# EAGLE design TinyCube12abc_Lib (EAGLE 7.5.0)

## Sheet 1 of 2
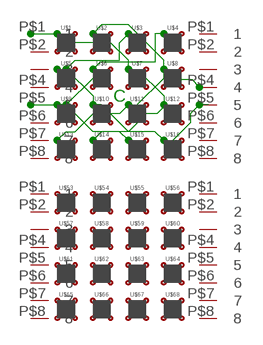
[diagram p0: schematic, sheet 1]

### Parts
JP1  TINY_HEADER_DEV  [TINY_HEADER_PKG]
JP2  TINY_HEADER_DEV  [TINY_HEADER_PKG]
JP3  TINY_HEADER_DEV  [TINY_HEADER_PKG]
JP4  TINY_HEADER_DEV  [TINY_HEADER_PKG]
U$1  PILLAR  [10MIL]
U$2  PILLAR  [10MIL]
U$3  PILLAR  [10MIL]
U$4  PILLAR  [10MIL]
U$5  PILLAR  [10MIL]
U$6  PILLAR  [10MIL]
U$7  PILLAR  [10MIL]
U$8  PILLAR  [10MIL]
U$9  PILLAR  [10MIL]
U$10  PILLAR  [10MIL]
U$11  PILLAR  [10MIL]
U$12  PILLAR  [10MIL]
U$13  PILLAR  [10MIL]
U$14  PILLAR  [10MIL]
U$15  PILLAR  [10MIL]
U$16  PILLAR  [10MIL]
U$53  PILLAR  [10MIL]
U$54  PILLAR  [10MIL]
U$55  PILLAR  [10MIL]
U$56  PILLAR  [10MIL]
U$57  PILLAR  [10MIL]
U$58  PILLAR  [10MIL]
U$59  PILLAR  [10MIL]
U$60  PILLAR  [10MIL]
U$61  PILLAR  [10MIL]
U$62  PILLAR  [10MIL]
U$63  PILLAR  [10MIL]
U$64  PILLAR  [10MIL]
U$65  PILLAR  [10MIL]
U$66  PILLAR  [10MIL]
U$67  PILLAR  [10MIL]
U$68  PILLAR  [10MIL]

### Nets
N$1: JP1.P$1 U$1.R(B) U$7.R(B) U$12.R(B) U$14.R(B)
N$2: JP2.P$4 U$2.R(B) U$8.R(B) U$11.R(B) U$13.R(B)
N$3: JP2.P$5 U$3.R(B) U$5.R(B) U$10.R(B) U$16.R(B)
N$5: JP1.P$5 U$4.R(B) U$6.R(B) U$9.R(B) U$15.R(B)
Unconnected: JP1.P$2 JP1.P$3 JP1.P$4 JP1.P$6 JP1.P$7 JP1.P$8 JP2.P$1 JP2.P$2 JP2.P$3 JP2.P$6 JP2.P$7 JP2.P$8 JP3.P$1 JP3.P$2 JP3.P$3 JP3.P$4 JP3.P$5 JP3.P$6 JP3.P$7 JP3.P$8 JP4.P$1 JP4.P$2 JP4.P$3 JP4.P$4 JP4.P$5 JP4.P$6 JP4.P$7 JP4.P$8 U$1.+(G) U$1.B(R) U$1.G(A) U$2.+(G) U$2.B(R) U$2.G(A) U$3.+(G) U$3.B(R) U$3.G(A) U$4.+(G) U$4.B(R) U$4.G(A) U$5.+(G) U$5.B(R) U$5.G(A) U$6.+(G) U$6.B(R) U$6.G(A) U$7.+(G) U$7.B(R) U$7.G(A) U$8.+(G) U$8.B(R) U$8.G(A) U$9.+(G) U$9.B(R) U$9.G(A) U$10.+(G) U$10.B(R) U$10.G(A) U$11.+(G) U$11.B(R) U$11.G(A) U$12.+(G) U$12.B(R) U$12.G(A) U$13.+(G) U$13.B(R) U$13.G(A) U$14.+(G) U$14.B(R) U$14.G(A) U$15.+(G) U$15.B(R) U$15.G(A) U$16.+(G) U$16.B(R) U$16.G(A) U$53.+(G) U$53.B(R) U$53.G(A) U$53.R(B) U$54.+(G) U$54.B(R) U$54.G(A) U$54.R(B) U$55.+(G) U$55.B(R) U$55.G(A) U$55.R(B) U$56.+(G) U$56.B(R) U$56.G(A) U$56.R(B) U$57.+(G) U$57.B(R) U$57.G(A) U$57.R(B) U$58.+(G) U$58.B(R) U$58.G(A) U$58.R(B) U$59.+(G) U$59.B(R) U$59.G(A) U$59.R(B) U$60.+(G) U$60.B(R) U$60.G(A) U$60.R(B) U$61.+(G) U$61.B(R) U$61.G(A) U$61.R(B) U$62.+(G) U$62.B(R) U$62.G(A) U$62.R(B) U$63.+(G) U$63.B(R) U$63.G(A) U$63.R(B) U$64.+(G) U$64.B(R) U$64.G(A) U$64.R(B) U$65.+(G) U$65.B(R) U$65.G(A) U$65.R(B) U$66.+(G) U$66.B(R) U$66.G(A) U$66.R(B) U$67.+(G) U$67.B(R) U$67.G(A) U$67.R(B) U$68.+(G) U$68.B(R) U$68.G(A) U$68.R(B)

### Notes on the sheet
- C

## Sheet 2 of 2
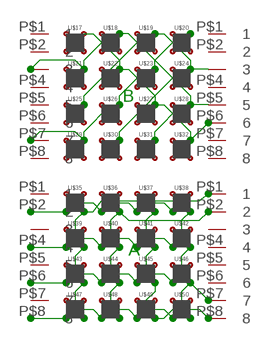
[diagram p1: schematic, sheet 2]

### Parts
U$17  PILLAR  [10MIL]
U$18  PILLAR  [10MIL]
U$19  PILLAR  [10MIL]
U$20  PILLAR  [10MIL]
U$21  PILLAR  [10MIL]
U$22  PILLAR  [10MIL]
U$23  PILLAR  [10MIL]
U$24  PILLAR  [10MIL]
U$25  PILLAR  [10MIL]
U$26  PILLAR  [10MIL]
U$27  PILLAR  [10MIL]
U$28  PILLAR  [10MIL]
U$29  PILLAR  [10MIL]
U$30  PILLAR  [10MIL]
U$31  PILLAR  [10MIL]
U$32  PILLAR  [10MIL]
U$33  TINY_HEADER_DEV  [TINY_HEADER_PKG]
U$34  TINY_HEADER_DEV  [TINY_HEADER_PKG]
U$35  PILLAR  [10MIL]
U$36  PILLAR  [10MIL]
U$37  PILLAR  [10MIL]
U$38  PILLAR  [10MIL]
U$39  PILLAR  [10MIL]
U$40  PILLAR  [10MIL]
U$41  PILLAR  [10MIL]
U$42  PILLAR  [10MIL]
U$43  PILLAR  [10MIL]
U$44  PILLAR  [10MIL]
U$45  PILLAR  [10MIL]
U$46  PILLAR  [10MIL]
U$47  PILLAR  [10MIL]
U$48  PILLAR  [10MIL]
U$49  PILLAR  [10MIL]
U$50  PILLAR  [10MIL]
U$51  TINY_HEADER_DEV  [TINY_HEADER_PKG]
U$52  TINY_HEADER_DEV  [TINY_HEADER_PKG]

### Nets
N$4: U$20.+(G) U$23.+(G) U$26.+(G) U$29.+(G) U$33.P$7
N$6: U$18.+(G) U$21.+(G) U$28.+(G) U$31.+(G) U$33.P$3 U$34.P$5
N$8: U$17.+(G) U$22.+(G) U$27.+(G) U$32.+(G) U$34.P$6
N$9: U$35.G(A) U$36.G(A) U$37.G(A) U$38.G(A) U$51.P$2
N$10: U$39.G(A) U$40.G(A) U$41.G(A) U$42.G(A) U$51.P$4
N$11: U$43.G(A) U$44.G(A) U$45.G(A) U$46.G(A) U$51.P$6
N$12: U$47.G(A) U$48.G(A) U$49.G(A) U$50.G(A) U$51.P$8
N$13: U$35.B(R) U$39.B(R) U$43.B(R) U$47.B(R) U$52.P$1
N$14: U$19.+(G) U$24.+(G) U$25.+(G) U$30.+(G) U$34.P$3
N$15: U$37.B(R) U$41.B(R) U$45.B(R) U$49.B(R) U$52.P$8
N$16: U$38.B(R) U$42.B(R) U$46.B(R) U$50.B(R) U$52.P$7
N$17: U$36.B(R) U$40.B(R) U$44.B(R) U$48.B(R) U$52.P$2
Unconnected: U$17.B(R) U$17.G(A) U$17.R(B) U$18.B(R) U$18.G(A) U$18.R(B) U$19.B(R) U$19.G(A) U$19.R(B) U$20.B(R) U$20.G(A) U$20.R(B) U$21.B(R) U$21.G(A) U$21.R(B) U$22.B(R) U$22.G(A) U$22.R(B) U$23.B(R) U$23.G(A) U$23.R(B) U$24.B(R) U$24.G(A) U$24.R(B) U$25.B(R) U$25.G(A) U$25.R(B) U$26.B(R) U$26.G(A) U$26.R(B) U$27.B(R) U$27.G(A) U$27.R(B) U$28.B(R) U$28.G(A) U$28.R(B) U$29.B(R) U$29.G(A) U$29.R(B) U$30.B(R) U$30.G(A) U$30.R(B) U$31.B(R) U$31.G(A) U$31.R(B) U$32.B(R) U$32.G(A) U$32.R(B) U$33.P$1 U$33.P$2 U$33.P$4 U$33.P$5 U$33.P$6 U$33.P$8 U$34.P$1 U$34.P$2 U$34.P$4 U$34.P$7 U$34.P$8 U$35.+(G) U$35.R(B) U$36.+(G) U$36.R(B) U$37.+(G) U$37.R(B) U$38.+(G) U$38.R(B) U$39.+(G) U$39.R(B) U$40.+(G) U$40.R(B) U$41.+(G) U$41.R(B) U$42.+(G) U$42.R(B) U$43.+(G) U$43.R(B) U$44.+(G) U$44.R(B) U$45.+(G) U$45.R(B) U$46.+(G) U$46.R(B) U$47.+(G) U$47.R(B) U$48.+(G) U$48.R(B) U$49.+(G) U$49.R(B) U$50.+(G) U$50.R(B) U$51.P$1 U$51.P$3 U$51.P$5 U$51.P$7 U$52.P$3 U$52.P$4 U$52.P$5 U$52.P$6

### Notes on the sheet
- B
- A

## Library data of the parts
JP1-JP4 U$33 U$34 U$51 U$52 = TinyHeader:TINY_HEADER_DEV
U$1-U$32 U$35-U$50 U$53-U$68 = PILLAR:PILLAR

## Board
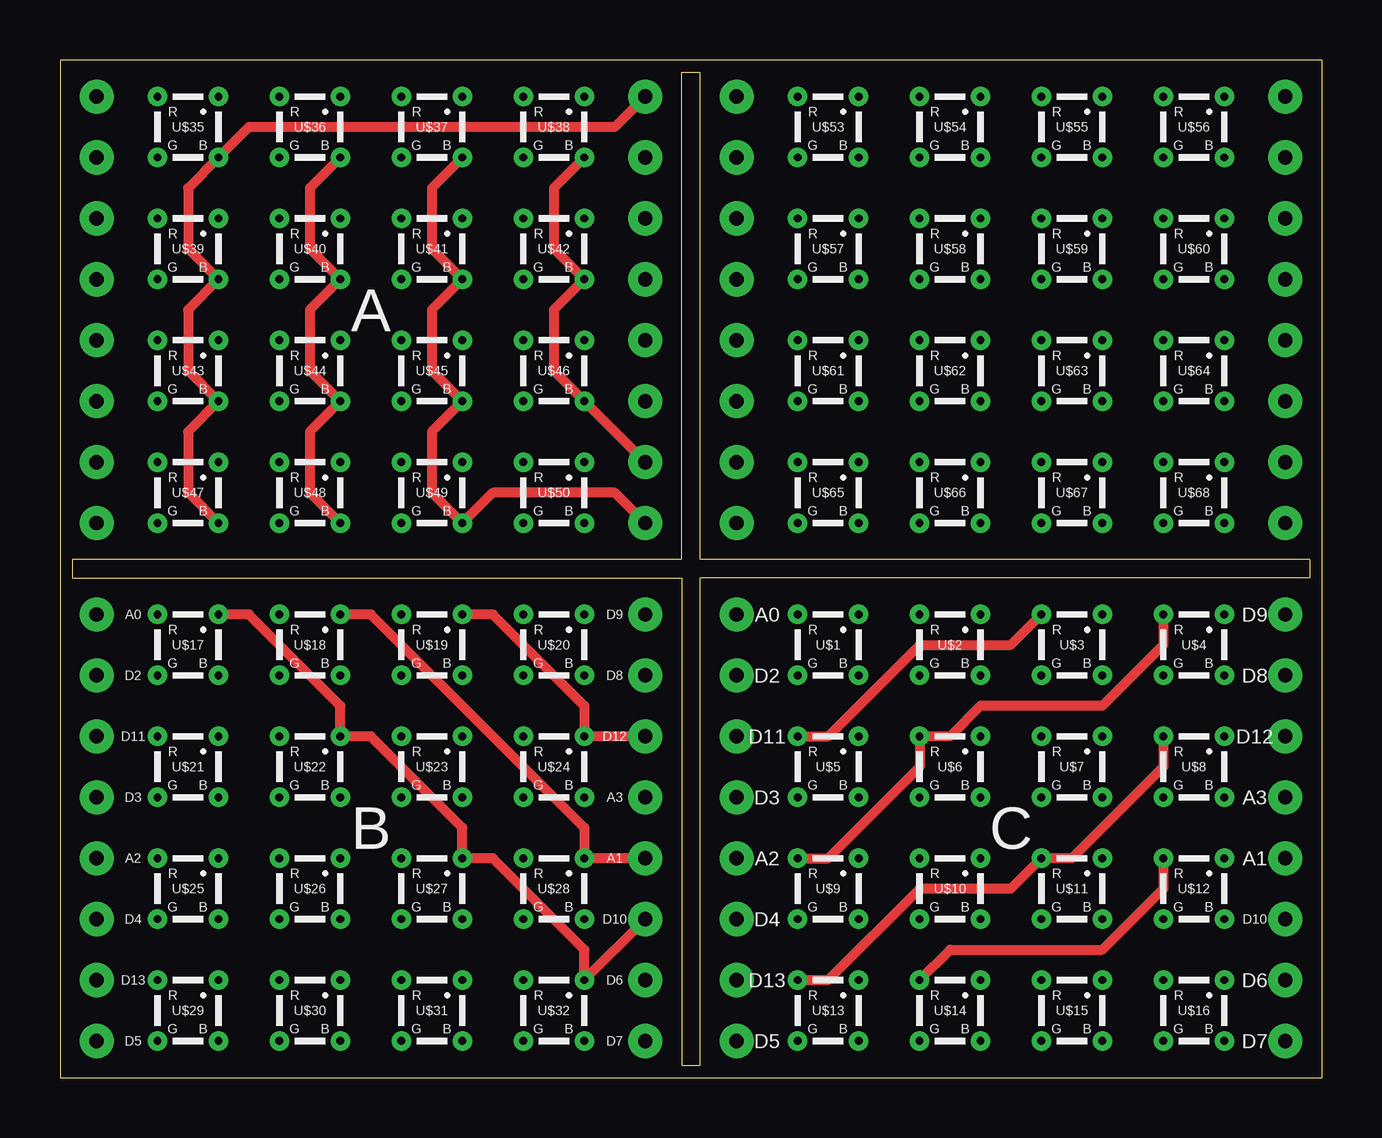
[diagram p2: board, top side]
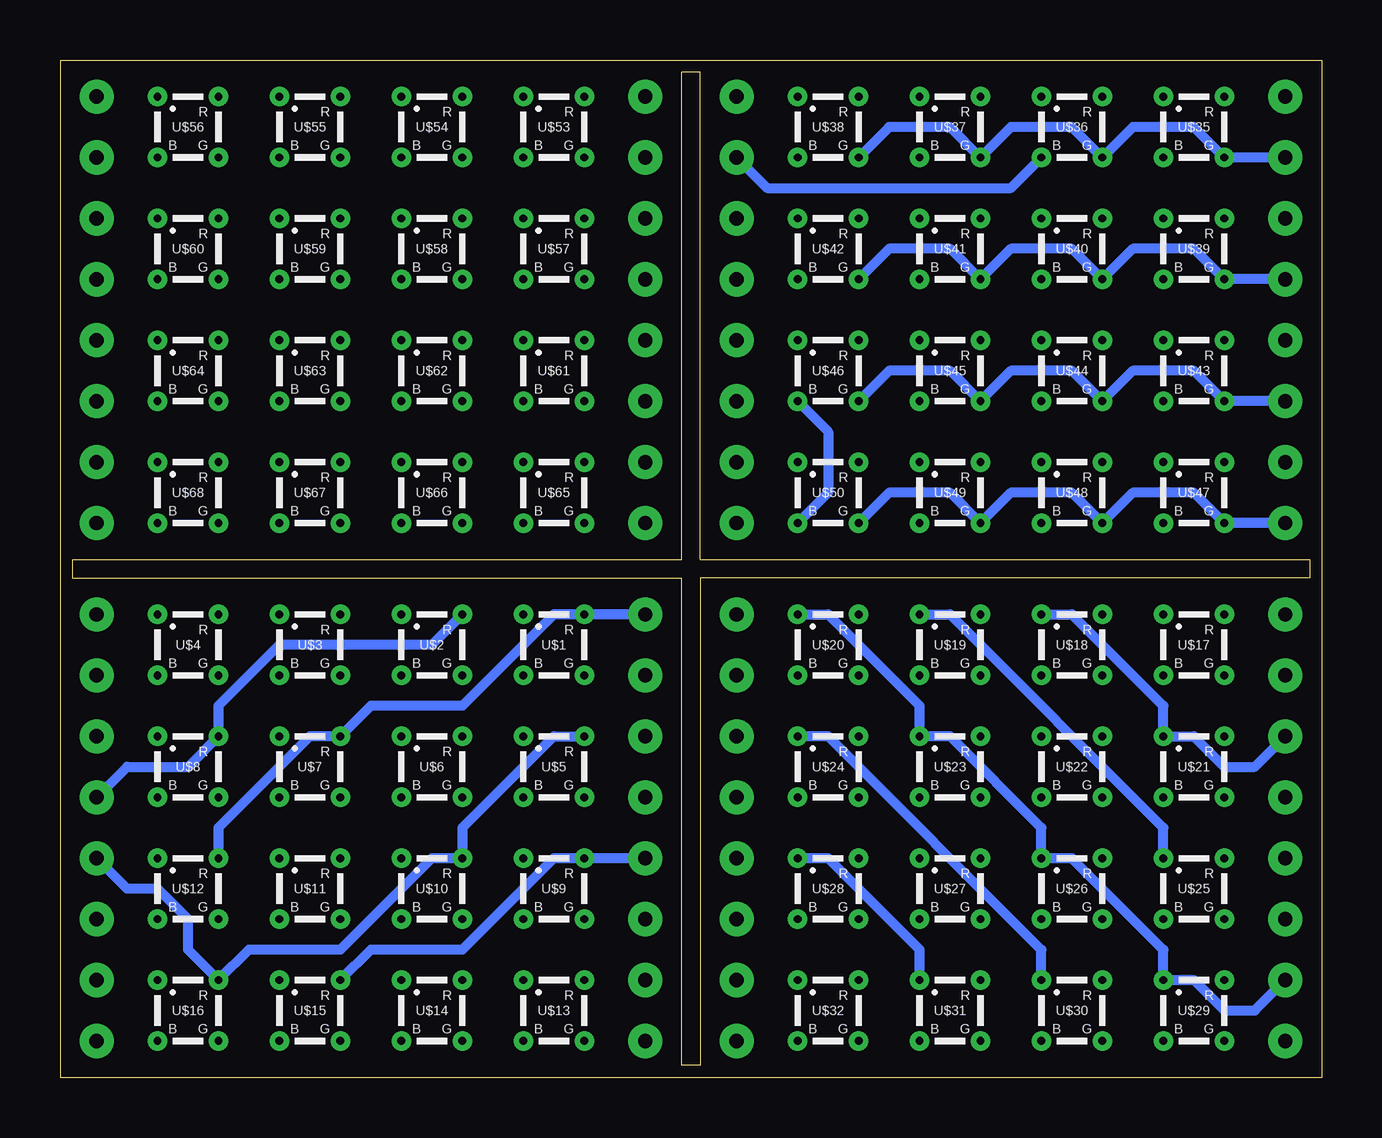
[diagram p3: board, bottom side, seen from below]

Size 52.58 x 42.42 mm. Coordinates in mm from the lower left corner, seen from the top.
Outline: 25.4,0 25.4,0
Outline: 52.58,42.42 52.58,0 0,0 0,42.42 52.58,42.42
Outline: 52.07,21.59 26.67,21.59 26.67,41.91 25.91,41.91 25.91,21.59 0.51,21.59 0.51,20.83 25.91,20.83 25.91,0.51 26.67,0.51 26.67,20.83 52.07,20.83 52.07,21.59
Copper layers (1*16): Top 0.0356mm / dielectric 1.5011mm / Bottom 0.0356mm
Design rules "LaenPCBOrder": minimum track width 6mil, minimum drill 13mil, track to track 6mil, track to pad 6mil, pad to pad 6mil, via to via 6mil, smd to smd 6mil, copper to edge 15mil, drill to drill 6mil, minimum pad ring 7mil, minimum via ring 7mil, stop-mask expansion 3mil, vias tented up to drill 0mil, thermal gap 10mil

### Footprints (pad centres in the part's own frame; a part is rotated, then mirrored left to right if it is on the bottom)
TINY_HEADER_PKG = drill 0.6 pad 1.422: P$1 0,0; P$2 0,-2.54; P$3 0,-5.08; P$4 0,-7.62; P$5 0,-10.16; P$6 0,-12.7; P$7 0,-15.24; P$8 0,-17.78
10MIL = drill 0.33 pad 0.813: + 1.27,1.27; B 1.27,-1.27; G -1.27,-1.27; R -1.27,1.27

### Placement (x,y rotation side)
JP1  28.19,19.3 0 top
JP2  51.05,19.3 0 top
JP3  28.19,40.89 0 top
JP4  51.05,40.89 0 top
U$1  32,18.03 0 top
U$2  37.08,18.03 0 top
U$3  42.16,18.03 0 top
U$4  47.24,18.03 0 top
U$5  32,12.95 0 top
U$6  37.08,12.95 0 top
U$7  42.16,12.95 0 top
U$8  47.24,12.95 0 top
U$9  32,7.87 0 top
U$10  37.08,7.87 0 top
U$11  42.16,7.87 0 top
U$12  47.24,7.87 0 top
U$13  32,2.79 0 top
U$14  37.08,2.79 0 top
U$15  42.16,2.79 0 top
U$16  47.24,2.79 0 top
U$17  5.33,18.03 0 top
U$18  10.41,18.03 0 top
U$19  15.49,18.03 0 top
U$20  20.57,18.03 0 top
U$21  5.33,12.95 0 top
U$22  10.41,12.95 0 top
U$23  15.49,12.95 0 top
U$24  20.57,12.95 0 top
U$25  5.33,7.87 0 top
U$26  10.41,7.87 0 top
U$27  15.49,7.87 0 top
U$28  20.57,7.87 0 top
U$29  5.33,2.79 0 top
U$30  10.41,2.79 0 top
U$31  15.49,2.79 0 top
U$32  20.57,2.79 0 top
U$33  1.52,19.3 0 top
U$34  24.38,19.3 0 top
U$35  5.33,39.62 0 top
U$36  10.41,39.62 0 top
U$37  15.49,39.62 0 top
U$38  20.57,39.62 0 top
U$39  5.33,34.54 0 top
U$40  10.41,34.54 0 top
U$41  15.49,34.54 0 top
U$42  20.57,34.54 0 top
U$43  5.33,29.46 0 top
U$44  10.41,29.46 0 top
U$45  15.49,29.46 0 top
U$46  20.57,29.46 0 top
U$47  5.33,24.38 0 top
U$48  10.41,24.38 0 top
U$49  15.49,24.38 0 top
U$50  20.57,24.38 0 top
U$51  1.52,40.89 0 top
U$52  24.38,40.89 0 top
U$53  32,39.62 0 top
U$54  37.08,39.62 0 top
U$55  42.16,39.62 0 top
U$56  47.24,39.62 0 top
U$57  32,34.54 0 top
U$58  37.08,34.54 0 top
U$59  42.16,34.54 0 top
U$60  47.24,34.54 0 top
U$61  32,29.46 0 top
U$62  37.08,29.46 0 top
U$63  42.16,29.46 0 top
U$64  47.24,29.46 0 top
U$65  32,24.38 0 top
U$66  37.08,24.38 0 top
U$67  42.16,24.38 0 top
U$68  47.24,24.38 0 top

### Tracks (layer width: path | path; a pad name or v marks a point on that pad's centre or on a via)
N$1
  Top 0.406: U$14.R 37.08,5.33 43.43,5.33 45.97,7.87 U$12.R
  Bottom 0.406: JP1.P$1 U$1.R 32,19.3 35.81,15.49 39.62,15.49 U$7.R 42.16,14.22 45.97,10.41 U$12.R
N$2
  Top 0.406: U$8.R 45.97,12.95 42.16,9.14 U$11.R 39.62,7.87 35.81,7.87 32,4.06 U$13.R
  Bottom 0.406: U$2.R 37.08,18.03 43.43,18.03 45.97,15.49 U$8.R 47.24,12.95 49.78,12.95 JP2.P$4
N$3
  Top 0.406: U$5.R 32,14.22 35.81,18.03 39.62,18.03 U$3.R
  Bottom 0.406: U$5.R 32,14.22 35.81,10.41 U$10.R 37.08,9.14 40.89,5.33 44.7,5.33 U$16.R 47.24,5.33 47.24,6.6 48.51,7.87 49.78,7.87 JP2.P$5
N$4
  Bottom 0.406: U$20.+ 20.57,19.3 16.76,15.49 U$23.+ 15.49,14.22 11.68,10.41 U$26.+ 10.41,9.14 6.6,5.33 U$29.+ 5.33,4.06 4.06,2.79 2.79,2.79 U$33.P$7
N$5
  Top 0.406: U$9.R 32,9.14 35.81,12.95 U$6.R 37.08,14.22 38.35,15.49 43.43,15.49 45.97,18.03 U$4.R
  Bottom 0.406: U$15.R 39.62,5.33 35.81,5.33 32,9.14 U$9.R JP1.P$5
N$6
  Top 0.406: U$18.+ 12.95,19.3 21.84,10.41 U$28.+ U$34.P$5
  Bottom 0.406: U$31.+ 16.76,5.33 20.57,9.14 U$28.+ | U$18.+ 10.41,19.3 6.6,15.49 U$21.+ 5.33,14.22 4.06,12.95 2.79,12.95 U$33.P$3
N$8
  Top 0.406: U$17.+ 7.87,19.3 11.68,15.49 U$22.+ 12.95,14.22 16.76,10.41 U$27.+ 18.03,9.14 21.84,5.33 U$32.+ U$34.P$6
N$9
  Bottom 0.406: U$51.P$2 U$35.G 5.33,39.62 7.87,39.62 U$36.G 10.41,39.62 12.95,39.62 U$37.G 15.49,39.62 18.03,39.62 U$38.G
N$10
  Bottom 0.406: U$51.P$4 U$39.G 5.33,34.54 7.87,34.54 U$40.G 10.41,34.54 12.95,34.54 U$41.G 15.49,34.54 18.03,34.54 U$42.G
N$11
  Bottom 0.406: U$51.P$6 U$43.G 5.33,29.46 7.87,29.46 U$44.G 10.41,29.46 12.95,29.46 U$45.G 15.49,29.46 18.03,29.46 U$46.G
N$12
  Bottom 0.406: U$51.P$8 U$47.G 5.33,24.38 7.87,24.38 U$48.G 10.41,24.38 12.95,24.38 U$49.G 15.49,24.38 18.03,24.38 U$50.G
N$13
  Top 0.406: U$52.P$1 23.11,39.62 7.87,39.62 U$35.B 5.33,37.08 5.33,34.54 U$39.B 5.33,32 5.33,29.46 U$43.B 5.33,26.92 5.33,24.38 U$47.B
N$14
  Top 0.406: U$19.+ 18.03,19.3 21.84,15.49 U$24.+ U$34.P$3
  Bottom 0.406: U$30.+ 11.68,5.33 20.57,14.22 U$24.+ | U$25.+ 6.6,10.41 15.49,19.3 U$19.+
N$15
  Top 0.406: U$37.B 15.49,37.08 15.49,34.54 U$41.B 15.49,32 15.49,29.46 U$45.B 15.49,26.92 15.49,24.38 U$49.B 18.03,24.38 23.11,24.38 U$52.P$8
N$16
  Top 0.406: U$38.B 20.57,37.08 20.57,34.54 U$42.B 20.57,32 20.57,29.46 U$46.B U$52.P$7
  Bottom 0.406: U$46.B 20.57,26.92 20.57,24.38 U$50.B
N$17
  Top 0.406: U$36.B 10.41,37.08 10.41,34.54 U$40.B 10.41,32 10.41,29.46 U$44.B 10.41,26.92 10.41,24.38 U$48.B
  Bottom 0.406: U$52.P$2 23.11,37.08 12.95,37.08 U$36.B

### Text on the board
tPlace: A
tNames: A0 | D9 | A0 | D9 | D2 | D8 | D2 | D8 | D11 | D12 | D11 | D12 | D3 | A3 | D3 | A3 | B | C | A2 | A1 | A2 | A1 | D4 | D10 | D4 | D10 | D13 | D6 | D13 | D6 | D5 | D7 | D5 | D7